# Altium schematic sheet fillcap_sensor.SchDoc: Sensor
size A3; DrawnBy: daniw / ninux; Organization: HSLU T&A; Address1: Abteilung Elektrotechnik; Address2: Technikumsstrasse 21; Address3: CH-6048 Horw; SheetNumber: 3; SheetTotal: 9; Projektname: fillcap
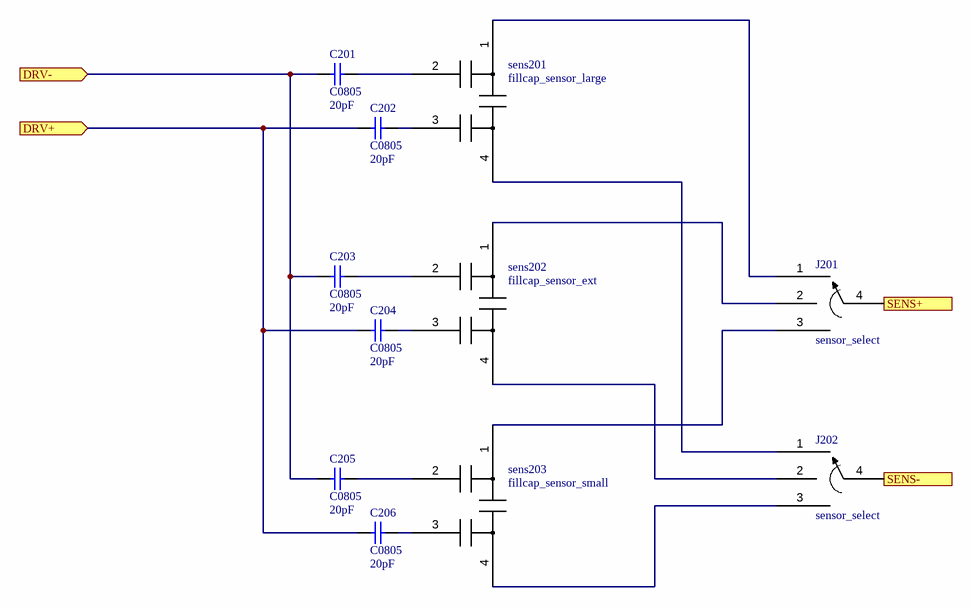
[diagram p0: fillcap_sensor.SchDoc]

## Parts
C201  C0805  value 20pF  [0805]
C202  C0805  value 20pF  [0805]
C203  C0805  value 20pF  [0805]
C204  C0805  value 20pF  [0805]
C205  C0805  value 20pF  [0805]
C206  C0805  value 20pF  [0805]
J201  sensor_select  [sens_select_jumper]
J202  sensor_select  [sens_select_jumper]
sens201  fillcap_sensor_large  [fillcap_sensor_large]
sens202  fillcap_sensor_ext  [fillcap_sensor_ext]
sens203  fillcap_sensor_small  [fillcap_sensor_small]

## Ports
DRV+ (in), DRV- (in), SENS+ (out), SENS- (out)

## Nets
DRV+: C202.2 C204.2 C206.2 ; port DRV+
DRV-: C201.2 C203.2 C205.2 ; port DRV-
SENS+: J201.4 ; port SENS+
SENS-: J202.4 ; port SENS-
NetC201_1: C201.1 sens201.2
NetC202_1: C202.1 sens201.3
NetC203_1: C203.1 sens202.2
NetC204_1: C204.1 sens202.3
NetC205_1: C205.1 sens203.2
NetC206_1: C206.1 sens203.3
NetJ201_1: J201.1 sens201.1
NetJ201_2: J201.2 sens202.1
NetJ201_3: J201.3 sens203.1
NetJ202_1: J202.1 sens201.4
NetJ202_2: J202.2 sens202.4
NetJ202_3: J202.3 sens203.4

## Notes on the sheet
- Project:
- Drawn by:
- Size:
- Sheet
- A3
- Rev.:
- of
- Date:
- File:

## Library data of the parts
C201-C206 = C0805: Ceramic Chip Capacitor - Standard; Note: Footprint corresponds to dimensions for bulk cassette packaging. This case size has tightened tolerances.; Published: 17-Jul-2002; LatestRevisionDate: 19-Mar-2004; LatestRevisionNote: Silkscreen size reduced.; DatasheetDocument: Mar-2001; PackageDocument: Mar-2001; PackageReference: 0805; Publisher: Altium Limited; Code_JEITA: 0805; Code_IPC: 2012[0805]; ComponentLink1Description: Manufacturer Link; ComponentLink1URL: http://www.kemet.com/; ComponentLink2Description: Datasheet; ComponentLink2URL: http://www.kemet.com/kemet/web/homepage/kechome.nsf/vapubfilesname/F3102TA.pdf/$file/F3102TA.pdf
sens201-sens203 = fillcap_sensor